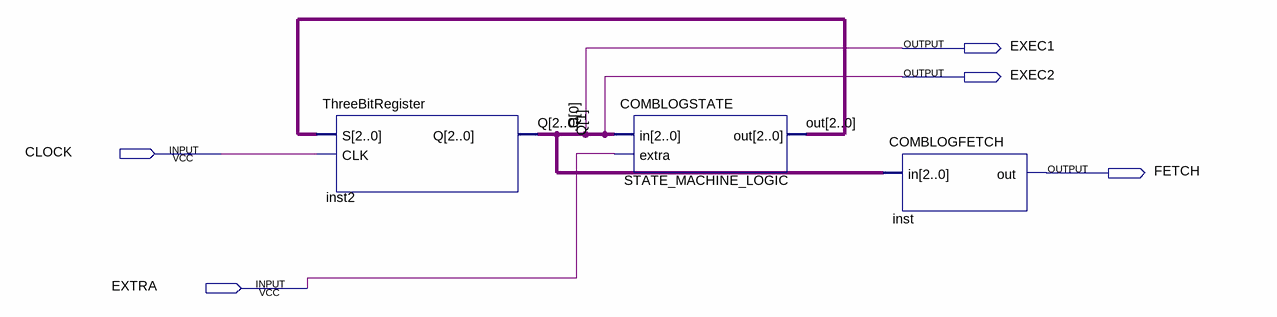
[diagram p0: schematic sheet]
// Quartus schematic STATE_MACHINE_BDF.bdf as structural Verilog: 3 symbols, 5 pins
module STATE_MACHINE_BDF (
  input  CLOCK,
  input  EXTRA,
  output EXEC1,
  output EXEC2,
  output FETCH
);

  wire [2:0] out;
  wire [2:2] Q;

  ThreeBitRegister inst2 (.S(out), .CLK(CLOCK), .Q({Q[2], EXEC2, EXEC1}));
  COMBLOGSTATE STATE_MACHINE_LOGIC (.in({Q[2], EXEC2, EXEC1}), .extra(EXTRA), .out(out));
  COMBLOGFETCH inst (.in({Q[2], EXEC2, EXEC1}), .out(FETCH));

  // Other names for the same wires on the sheet: Q[1:0] = {EXEC2, EXEC1}
endmodule
